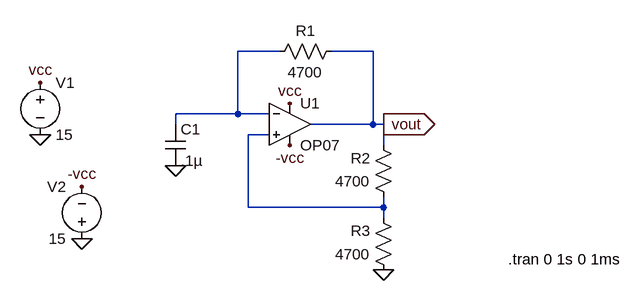
[diagram p0: schematic astable.asc]
astable.asc, the LTspice schematic file:
Version 4.1
SHEET 1 880 680
WIRE 176 32 112 32
WIRE 320 32 256 32
WIRE 112 128 112 32
WIRE 112 128 16 128
WIRE 160 128 112 128
WIRE 16 144 16 128
WIRE 320 144 320 32
WIRE 320 144 224 144
WIRE 336 144 320 144
WIRE 160 160 128 160
WIRE 336 176 336 144
WIRE 128 272 128 160
WIRE 336 272 336 256
WIRE 336 272 128 272
WIRE 336 288 336 272
FLAG 16 208 0
FLAG 336 368 0
FLAG 336 144 vout
IOPIN 336 144 Out
FLAG -192 160 0
FLAG -192 80 vcc
FLAG 192 112 vcc
FLAG -128 320 0
FLAG -128 240 -vcc
FLAG 192 176 -vcc
SYMBOL OpAmps\\OP07 192 80 R0
SYMATTR InstName U1
SYMBOL cap 0 144 R0
SYMATTR InstName C1
SYMATTR Value .1µ
SYMBOL res 272 16 R90
WINDOW 0 0 56 VBottom 2
WINDOW 3 32 56 VTop 2
SYMATTR InstName R1
SYMATTR Value 4700
SYMBOL res 352 272 R180
WINDOW 0 36 76 Left 2
WINDOW 3 36 40 Left 2
SYMATTR InstName R2
SYMATTR Value 4700
SYMBOL res 352 384 R180
WINDOW 0 36 76 Left 2
WINDOW 3 36 40 Left 2
SYMATTR InstName R3
SYMATTR Value 4700
SYMBOL voltage -192 64 R0
WINDOW 123 0 0 Left 0
WINDOW 39 0 0 Left 0
SYMATTR InstName V1
SYMATTR Value 15
SYMBOL voltage -128 336 R180
WINDOW 0 24 96 Left 2
WINDOW 3 24 16 Left 2
WINDOW 123 0 0 Left 0
WINDOW 39 0 0 Left 0
SYMATTR InstName V2
SYMATTR Value 15
TEXT 528 352 Left 2 !.tran 0 1s 0 1ms

The netlist it stands for:
* astable.asc
X§U1 N002 N001 vcc -vcc vout LT1001  ; OP07, pins In+ In- V+ V- OUT
C1 N001 0 .1µ
R1 vout N001 4700
R2 N002 vout 4700
R3 0 N002 4700
V1 vcc 0 15
V2 0 -vcc 15
.tran 0 1s 0 1ms
.lib LTC.lib
.backanno
.end